# Altium project TPS55340_BOOST_PCB.PrjPCB
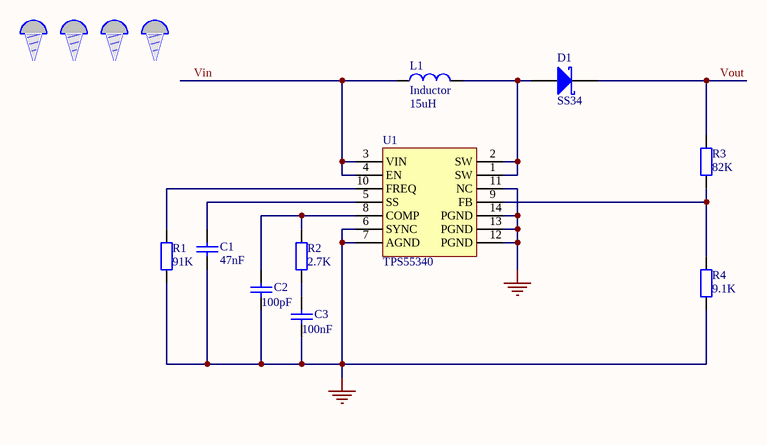
[diagram p0: TPS55340_BOOST_PCB.SchDoc]
1 sheet, 14 parts. Net scope: global (net labels, ports and power ports of the same name join across sheets).
Board file: TPS55340_BOOST_PCB.PcbDoc

## Sheet TPS55340_BOOST_PCB.SchDoc
size A4

### Parts
C1  value 47nF  [CAPC1608N]  (hidden comment: Cap1)
C2  value 100pF  [CAPC1608N]  (hidden comment: Cap1)
C3  value 100nF  [CAPC1608N]  (hidden comment: Cap1)
D1  SS34  [DO-214AC]
L1  Inductor  value 15uH  [贴片680u]
M1  M  [TAPPING HOLE]  (value not drawn)
M2  M  [TAPPING HOLE]  (value not drawn)
M3  M  [TAPPING HOLE]  (value not drawn)
M4  M  [TAPPING HOLE]  (value not drawn)
R1  value 91K  [RESC1608N]  (hidden comment: Res1)
R2  value 2.7K  [RESC1608N]  (hidden comment: Res1)
R3  value 82K  [RESC1608N]  (hidden comment: Res1)
R4  value 9.1K  [RESC1608N]  (hidden comment: Res1)
U1  TPS55340  [TSSOP14_L]

### Nets
GND: C1.1 C2.1 C3.1 R1.1 R4.1 U1.6(SYNC) U1.7(AGND) U1.11(NC) U1.12(PGND) U1.13(PGND) U1.14(PGND)
Vin: L1.1 U1.3(VIN) U1.4(EN)
Vout: D1.2(K) R3.2
NetC1_2: C1.2 U1.5(SS)
NetC2_2: C2.2 R2.2 U1.8(COMP)
NetC3_2: C3.2 R2.1
NetD1_1: D1.1(A) L1.2 U1.1(SW) U1.2(SW)
NetR1_2: R1.2 U1.10(FREQ)
NetR3_1: R3.1 R4.2 U1.9(FB)

### Library data of the parts
C1-C3 = Cap1: Capacitor; Published: 8-Jun-2000; LatestRevisionDate: 17-Jul-2002; LatestRevisionNote: Re-released for DXP Platform.; PackageReference: RAD-0.3; Publisher: Altium Limited
D1 = D Schottky: Schottky Diode; Published: 8-Jun-2000; LatestRevisionDate: 17-Jul-2002; LatestRevisionNote: Re-released for DXP Platform.; PackageReference: SMB; Publisher: Altium Limited; Code_JEDEC: DO-214-AA
L1 = Inductor: Code_IEC: 1005; Published: 8-Jun-2000; LatestRevisionDate: 29-May-2009; LatestRevisionNote: IPC-7351 Footprint Added.; PackageReference: 0402-A; Publisher: Altium Limited; PackageDescription: Chip Inductor; Code_JEITA: 0402
R1-R4 = Res1: Resistor; Published: 8-Jun-2000; LatestRevisionDate: 17-Jul-2002; LatestRevisionNote: Re-released for DXP Platform.; PackageReference: AXIAL-0.4; Publisher: Altium Limited